# EAGLE board ordered_nobrain_416 (EAGLE 4.16), part 1 of 2
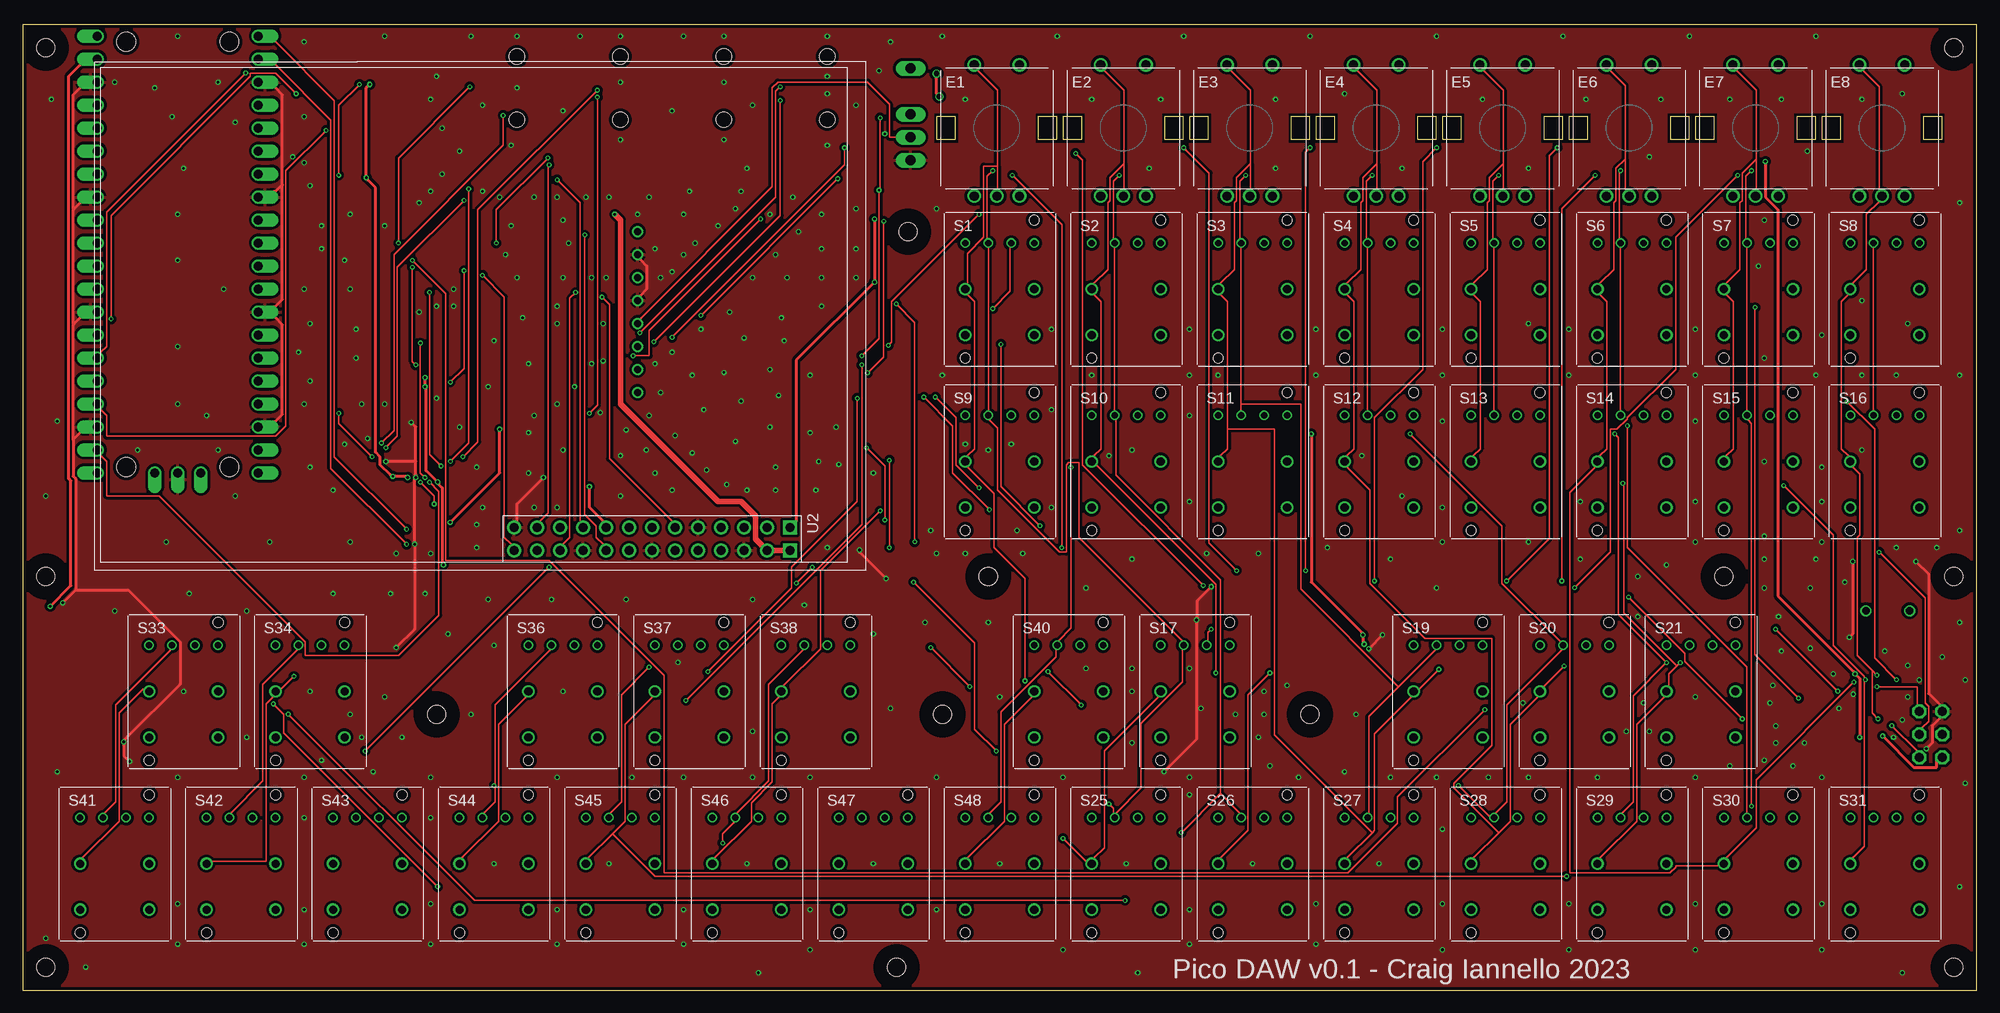
[diagram p1: board, top side]
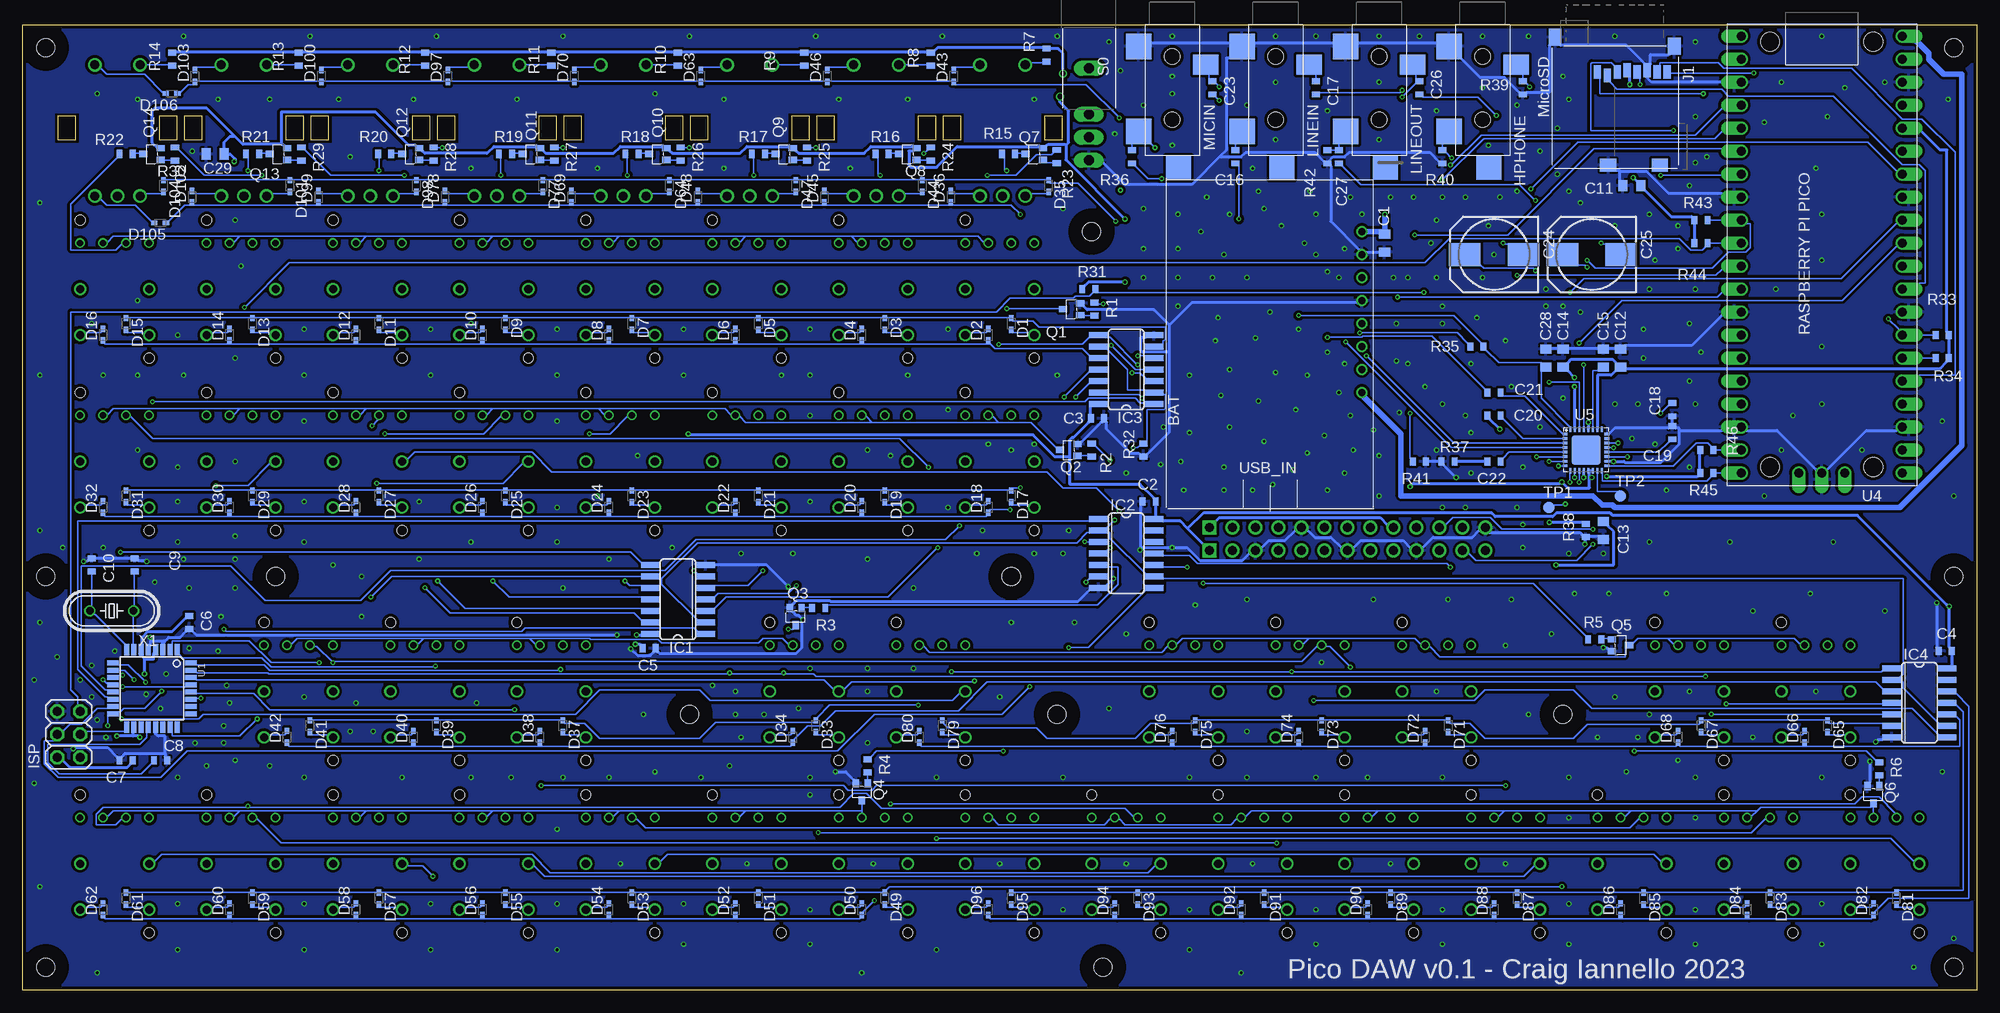
[diagram p2: board, bottom side, seen from below]

Size 215.9 x 106.68 mm. Coordinates in mm from the lower left corner, seen from the top.
Outline: 0,0 215.9,0 215.9,106.68 0,106.68 0,0
Copper layers (1*16): Top 0.0356mm / dielectric 1.6mm / Bottom 0.0356mm
Design rules "oshpark-2layer": minimum track width 6mil, minimum drill 10mil, track to track 6mil, track to pad 6mil, pad to pad 6mil, via to via 6mil, smd to smd 6mil, copper to edge 15mil, drill to drill 6mil, minimum pad ring 5mil, minimum via ring 5mil, stop-mask expansion 2.5mil, vias tented up to drill 0mil, thermal gap 10mil
Net classes: 0 default: width 0.152 mm, drill 0.152 mm, clearance 0.254 mm; 1 high_power: width 0.61 mm, drill 0.33 mm, clearance 0.61 mm; 2 mid_power: width 0.305 mm, drill 0.152 mm, clearance 0.305 mm
Holes 2 mm at 213.36,2.54 213.36,104.14 2.54,104.14 2.54,2.54 45.72,30.48 96.52,2.54 142.24,30.48 97.79,83.82 213.36,45.72 106.68,45.72 2.54,45.72 101.6,30.48 187.96,45.72
tRestrict: area 0,101.6 to 5.1,106.7; area 0,43.2 to 5.1,48.3; area 0,0 to 5.1,5.1; area 43.2,27.9 to 48.3,33; area 99.1,27.9 to 104.1,33; area 104.1,43.2 to 109.2,48.3; area 95.2,81.3 to 100.3,86.4; area 94,0 to 99.1,5.1; area 139.7,27.9 to 144.8,33; area 185.4,43.2 to 190.5,48.3; area 210.8,43.2 to 215.9,48.3; area 210.8,0 to 215.9,5.1; 1 more areas
bRestrict: area 0,101.6 to 5.1,106.7; area 0,43.2 to 5.1,48.3; area 0,0 to 5.1,5.1; area 43.2,27.9 to 48.3,33; area 99.1,27.9 to 104.1,33; area 104.1,43.2 to 109.2,48.3; area 95.2,81.3 to 100.3,86.4; area 94,0 to 99.1,5.1; area 139.7,27.9 to 144.8,33; area 185.4,43.2 to 190.5,48.3; area 210.8,43.2 to 215.9,48.3; area 210.8,0 to 215.9,5.1; 1 more areas

## Footprints (pad centres in the part's own frame; a part is rotated, then mirrored left to right if it is on the bottom)
0805 = smd 1.25 x 1: 1 0,1; 2 0,-1
0603 = smd 0.65 x 0.9: 1 -0.725,0; 2 0.725,0
150CLZ-0810 = smd 3.5 x 2.5: + 3.25,0; - -3.25,0
SOD523 = smd 0.7 x 0.5: A 0.7,0; C -0.6,0
ENCODER_BOURNS_PEC12R-3225F-S0024 = drill 1 round: A -2.5,-7.5; B 2.5,-7.5; COM 0,-7.5; SW0 -2.5,7; SW1 2.5,7
HPHONE_CUI_SJ-3524-SMT-TR = smd 2.2 x 2.8: RING 4.4,3.7 | smd 2.8 x 2.8: SLEEVE 2.4,-3.7; TIP 11.8,-3.7 | smd 2.6 x 2.8: SWITCH 15.8,0.7 | hole 1.7: 3.5,0; 10.5,0
SO14 = smd 0.66 x 2.032: 1 -3.81,-3.073; 2 -2.54,-3.073; 3 -1.27,-3.073; 4 0,-3.073; 5 1.27,-3.073; 6 2.54,-3.073; 7 3.81,-3.073; 8 3.81,3.073; 9 2.54,3.073; 10 1.27,3.073; 11 0,3.073; 12 -1.27,3.073; 13 -2.54,3.073; 14 -3.81,3.073
2X03 = drill 1.016 octagon: 1 -2.54,-1.27; 2 -2.54,1.27; 3 0,-1.27; 4 0,1.27; 5 2.54,-1.27; 6 2.54,1.27
MICROSD_AMPHENOL_GTFP08432B1HR = smd 0.8 x 1.5: 1/DAT2 1.95,1.8; 2/CD/DAT3 0.85,2.2; 3/CMD -0.25,1.8; 4/VDD -1.35,1.6; 5/CLK -2.45,1.8; 6/VSS -3.55,1.6; 7/DAT0 -4.65,1.8; 8/DAT1 -5.75,1.8 | smd 1.8 x 1.4: CDET -4.95,12.1; GND0 0.75,12.1 | smd 1.4 x 1.9: GND1 -6.55,-1.05; GND2 6.6,-2.05
SC-70-3_SOT-323 = smd 0.7 x 0.9: 1 -0.65,-0.95; 2 0.65,-0.95; 3 0,0.95
ROCKER_SPDT_EG4328-ND = drill 1.09 long: 1 0,-5.135; 2 0,-7.675; 3 0,-10.215; ANCH 0,-0.055
PAD_PB86-A1 = drill 0.7 round: A -1.27,5.08; K 1.27,5.08; NC0 -3.81,5.08; NC1 3.81,5.08 | drill 0.9 round: COM0 -3.81,0; COM1 3.81,0; NC 3.81,-5.08; NO -3.81,-5.08 | hole 1.1: -3.81,-7.62; 3.81,7.62
B1,27 = smd 1.27 x 1.27: PP 0,0
TQFP32-08 = smd 1.27 x 0.559: 1 -4.293,2.8; 2 -4.293,2; 3 -4.293,1.2; 4 -4.293,0.4; 5 -4.293,-0.4; 6 -4.293,-1.2; 7 -4.293,-2; 8 -4.293,-2.8; 17 4.293,-2.8; 18 4.293,-2; 19 4.293,-1.2; 20 4.293,-0.4; 21 4.293,0.4; 22 4.293,1.2; 23 4.293,2; 24 4.293,2.8 | smd 0.559 x 1.27: 9 -2.8,-4.293; 10 -2,-4.293; 11 -1.2,-4.293; 12 -0.4,-4.293; 13 0.4,-4.293; 14 1.2,-4.293; 15 2,-4.293; 16 2.8,-4.293; 25 2.8,4.293; 26 2,4.293; 27 1.2,4.293; 28 0.4,4.293; 29 -0.4,4.293; 30 -1.2,4.293; 31 -2,4.293; 32 -2.8,4.293
WAVESHARE_SPI_3.5_480X320 = drill 1.016 square: 1 0,-2.54; 2 0,0 | drill 1.016 round: 3 2.54,-2.54; 4 2.54,0; 5 5.08,-2.54; 6 5.08,0; 7 7.62,-2.54; 8 7.62,0; 9 10.16,-2.54; 10 10.16,0; 11 12.7,-2.54; 12 12.7,0; 13 15.24,-2.54; 14 15.24,0; 15 17.78,-2.54; 16 17.78,0; 17 20.32,-2.54; 18 20.32,0; 19 22.86,-2.54; 20 22.86,0; 21 25.4,-2.54; 22 25.4,0; 23 27.94,-2.54; 24 27.94,0; 25 30.48,-2.54; 26 30.48,0
ADAFRUIT_POWERBOOST_1000C = drill 0.8 round: 5V 8.89,0; BAT -6.35,0; EN -1.27,0; GND0 1.27,0; GND1 6.35,0; LOWBAT 3.81,0; USB -8.89,0; VS -3.81,0
PI_PICO = drill 1 offset: 1 -8.89,24.13; 2 -8.89,21.59; 3 -8.89,19.05; 4 -8.89,16.51; 5 -8.89,13.97; 6 -8.89,11.43; 7 -8.89,8.89; 8 -8.89,6.35; 9 -8.89,3.81; 10 -8.89,1.27; 11 -8.89,-1.27; 12 -8.89,-3.81; 13 -8.89,-6.35; 14 -8.89,-8.89; 15 -8.89,-11.43; 16 -8.89,-13.97; 17 -8.89,-16.51; 18 -8.89,-19.05; 19 -8.89,-21.59; 20 -8.89,-24.13; 21 8.89,-24.13; 22 8.89,-21.59; 23 8.89,-19.05; 24 8.89,-16.51; 25 8.89,-13.97; 26 8.89,-11.43; 27 8.89,-8.89; 28 8.89,-6.35; 29 8.89,-3.81; 30 8.89,-1.27; 31 8.89,1.27; 32 8.89,3.81; 33 8.89,6.35; 34 8.89,8.89; 35 8.89,11.43; 36 8.89,13.97; 37 8.89,16.51; 38 8.89,19.05; 39 8.89,21.59; 40 8.89,24.13; D1 -2.54,-24.13; D2 0,-24.13; D3 2.54,-24.13 | hole 2.1: -5.7,23.5; 5.7,23.5; 5.7,-23.5; -5.7,-23.5
QFN32 = smd 0.6 x 0.3: 1 -2.3,1.75; 2 -2.3,1.25; 3 -2.3,0.75; 4 -2.3,0.25; 5 -2.3,-0.25; 6 -2.3,-0.75; 7 -2.3,-1.25; 8 -2.3,-1.75; 17 2.3,-1.75; 18 2.3,-1.25; 19 2.3,-0.75; 20 2.3,-0.25; 21 2.3,0.25; 22 2.3,0.75; 23 2.3,1.25; 24 2.3,1.75 | smd 0.3 x 0.6: 9 -1.75,-2.3; 10 -1.25,-2.3; 11 -0.75,-2.3; 12 -0.25,-2.3; 13 0.25,-2.3; 14 0.75,-2.3; 15 1.25,-2.3; 16 1.75,-2.3; 25 1.75,2.3; 26 1.25,2.3; 27 0.75,2.3; 28 0.25,2.3; 29 -0.25,2.3; 30 -0.75,2.3; 31 -1.25,2.3; 32 -1.75,2.3 | smd 3.2 x 3.2: EXP 0,0
HC49/S = drill 0.813 round: 1 -2.413,0; 2 2.413,0

## Placement (x,y rotation side)
C1  10u  [0805]  65.43,82.55 0 bottom
C2  0.1u  [0603]  91.44,53.98 180 bottom
C3  0.1u  [0603]  97.16,63.18 0 bottom
C4  0.1u  [0603]  3.49,37.47 180 bottom
C5  0.1u  [0603]  146.69,37.78 0 bottom
C6  0.1u  [0603]  197.49,40.64 270 bottom
C7  0.1u  [0603]  204.47,25.4 180 bottom
C8  0.1u  [0603]  200.66,25.4 0 bottom
C9  22p  [0603]  203.52,46.99 270 bottom
C10  22p  [0603]  208.28,46.99 270 bottom
C11  10u  [0805]  38.1,88.9 270 bottom
C12  10u  [0805]  39.37,69.85 180 bottom
C13  10u  [0805]  41.27,50.8 0 bottom
C14  10u  [0805]  45.72,69.85 180 bottom
C15  10u  [0805]  41.27,69.85 180 bottom
C16  1u  [0603]  81.92,92.08 270 bottom
C17  1u  [0603]  73.03,99.69 270 bottom
C18  1u  [0603]  33.66,64.14 90 bottom
C19  1u  [0603]  33.66,61.59 270 bottom
C20  1u  [0603]  53.34,63.5 0 bottom
C21  1u  [0603]  53.34,66.04 0 bottom
C22  1u  [0603]  53.34,58.42 0 bottom
C23  1u  [0603]  84.45,99.69 270 bottom
C24  220u  [150CLZ-0810]  53.34,81.28 180 bottom
C25  220u  [150CLZ-0810]  42.55,81.28 180 bottom
C26  1u  [0603]  61.59,99.69 90 bottom
C27  1u  [0603]  70.48,92.08 90 bottom
C28  10u  [0805]  47.62,69.85 180 bottom
C29  10u  [0805]  194.63,92.39 270 bottom
D1  [SOD523]  106.68,73.66 270 bottom
D2  [SOD523]  109.22,72.39 90 bottom
D3  [SOD523]  120.65,73.66 270 bottom
D4  [SOD523]  123.19,72.39 90 bottom
D5  [SOD523]  134.62,73.66 270 bottom
D6  [SOD523]  137.16,72.39 90 bottom
D7  [SOD523]  148.59,73.66 270 bottom
D8  [SOD523]  151.13,72.39 90 bottom
D9  [SOD523]  162.56,73.66 270 bottom
D10  [SOD523]  165.1,72.39 90 bottom
D11  [SOD523]  176.53,73.66 270 bottom
D12  [SOD523]  179.07,72.39 90 bottom
D13  [SOD523]  190.5,73.66 270 bottom
D14  [SOD523]  193.04,72.39 90 bottom
D15  [SOD523]  204.47,73.66 270 bottom
D16  [SOD523]  207.01,72.39 90 bottom
D17  [SOD523]  106.68,54.61 270 bottom
D18  [SOD523]  109.22,53.34 90 bottom
D19  [SOD523]  120.65,54.61 270 bottom
D20  [SOD523]  123.19,53.34 90 bottom
D21  [SOD523]  134.62,54.61 270 bottom
D22  [SOD523]  137.16,53.34 90 bottom
D23  [SOD523]  148.59,54.61 270 bottom
D24  [SOD523]  151.13,53.34 90 bottom
D25  [SOD523]  162.56,54.61 270 bottom
D26  [SOD523]  165.1,53.34 90 bottom
D27  [SOD523]  176.53,54.61 270 bottom
D28  [SOD523]  179.07,53.34 90 bottom
D29  [SOD523]  190.5,54.61 270 bottom
D30  [SOD523]  193.04,53.34 90 bottom
D31  [SOD523]  204.47,54.61 270 bottom
D32  [SOD523]  207.01,53.34 90 bottom
D33  [SOD523]  128.27,29.21 270 bottom
D34  [SOD523]  130.81,27.94 90 bottom
D35  [SOD523]  102.55,88.9 270 bottom
D36  [SOD523]  113.35,87.63 90 bottom
D37  [SOD523]  156.21,29.21 270 bottom
D38  [SOD523]  158.75,27.94 90 bottom
D39  [SOD523]  170.18,29.21 270 bottom
D40  [SOD523]  172.72,27.94 90 bottom
D41  [SOD523]  184.15,29.21 270 bottom
D42  [SOD523]  186.69,27.94 90 bottom
D43  [SOD523]  113.03,100.97 90 bottom
D44  [SOD523]  116.52,88.9 270 bottom
D45  [SOD523]  127.32,87.63 90 bottom
D46  [SOD523]  127,100.97 90 bottom
D47  [SOD523]  130.49,88.9 270 bottom
D48  [SOD523]  141.29,87.63 90 bottom
D49  [SOD523]  120.65,10.16 270 bottom
D50  [SOD523]  123.19,8.89 90 bottom
D51  [SOD523]  134.62,10.16 270 bottom
D52  [SOD523]  137.16,8.89 90 bottom
D53  [SOD523]  148.59,10.16 270 bottom
D54  [SOD523]  151.13,8.89 90 bottom
D55  [SOD523]  162.56,10.16 270 bottom
D56  [SOD523]  165.1,8.89 90 bottom
D57  [SOD523]  176.53,10.16 270 bottom
D58  [SOD523]  179.07,8.89 90 bottom
D59  [SOD523]  190.5,10.16 270 bottom
D60  [SOD523]  193.04,8.89 90 bottom
D61  [SOD523]  204.47,10.16 270 bottom
D62  [SOD523]  207.01,8.89 90 bottom
D63  [SOD523]  140.97,100.97 90 bottom
D64  [SOD523]  144.46,88.9 270 bottom
D65  [SOD523]  16.51,29.21 270 bottom
D66  [SOD523]  19.05,27.94 90 bottom
D67  [SOD523]  30.48,29.21 270 bottom
D68  [SOD523]  33.02,27.94 90 bottom
D69  [SOD523]  155.26,87.63 90 bottom
D70  [SOD523]  154.94,100.97 90 bottom
D71  [SOD523]  58.42,29.21 270 bottom
D72  [SOD523]  60.96,27.94 90 bottom
D73  [SOD523]  72.39,29.21 270 bottom
D74  [SOD523]  74.93,27.94 90 bottom
D75  [SOD523]  86.36,29.21 270 bottom
D76  [SOD523]  88.9,27.94 90 bottom
D77  [SOD523]  158.43,88.9 270 bottom
D78  [SOD523]  169.23,87.63 90 bottom
D79  [SOD523]  114.3,29.21 270 bottom
D80  [SOD523]  116.84,27.94 90 bottom
D81  [SOD523]  8.89,10.16 270 bottom
D82  [SOD523]  11.43,8.89 90 bottom
D83  [SOD523]  22.86,10.16 270 bottom
D84  [SOD523]  25.4,8.89 90 bottom
D85  [SOD523]  36.83,10.16 270 bottom
D86  [SOD523]  39.37,8.89 90 bottom
D87  [SOD523]  50.8,10.16 270 bottom
D88  [SOD523]  53.34,8.89 90 bottom
D89  [SOD523]  64.77,10.16 270 bottom
D90  [SOD523]  67.31,8.89 90 bottom
D91  [SOD523]  78.74,10.16 270 bottom
D92  [SOD523]  81.28,8.89 90 bottom
D93  [SOD523]  92.71,10.16 270 bottom
D94  [SOD523]  95.25,8.89 90 bottom
D95  [SOD523]  106.68,10.16 270 bottom
D96  [SOD523]  109.22,8.89 90 bottom
D97  [SOD523]  168.91,100.97 90 bottom
D98  [SOD523]  172.4,88.9 270 bottom
D99  [SOD523]  183.2,87.63 90 bottom
D100  [SOD523]  182.88,100.97 90 bottom
D101  [SOD523]  186.37,88.9 270 bottom
D102  [SOD523]  197.17,87.63 90 bottom
D103  [SOD523]  196.85,100.97 90 bottom
D104  [SOD523]  200.34,88.9 270 bottom
D105  [SOD523]  200.66,84.77 180 bottom
D106  [SOD523]  199.39,99.06 180 bottom
E1  ENCODER_BOURNS_PEC12R-3225F-S0024  [ENCODER_BOURNS_PEC12R-3225F-S0024]  107.63,95.25 0 top
E2  ENCODER_BOURNS_PEC12R-3225F-S0024  [ENCODER_BOURNS_PEC12R-3225F-S0024]  121.6,95.25 0 top
E3  ENCODER_BOURNS_PEC12R-3225F-S0024  [ENCODER_BOURNS_PEC12R-3225F-S0024]  135.57,95.25 0 top
E4  ENCODER_BOURNS_PEC12R-3225F-S0024  [ENCODER_BOURNS_PEC12R-3225F-S0024]  149.54,95.25 0 top
E5  ENCODER_BOURNS_PEC12R-3225F-S0024  [ENCODER_BOURNS_PEC12R-3225F-S0024]  163.51,95.25 0 top
E6  ENCODER_BOURNS_PEC12R-3225F-S0024  [ENCODER_BOURNS_PEC12R-3225F-S0024]  177.48,95.25 0 top
E7  ENCODER_BOURNS_PEC12R-3225F-S0024  [ENCODER_BOURNS_PEC12R-3225F-S0024]  191.45,95.25 0 top
E8  ENCODER_BOURNS_PEC12R-3225F-S0024  [ENCODER_BOURNS_PEC12R-3225F-S0024]  205.42,95.25 0 top
HPHONE  [HPHONE_CUI_SJ-3524-SMT-TR]  54.61,106.68 270 bottom
IC1  74LS164D  [SO14]  143.51,43.18 90 bottom
IC2  74LS164D  [SO14]  93.98,48.26 270 bottom
IC3  74LS164D  [SO14]  93.98,68.58 90 bottom
IC4  74LS164D  [SO14]  6.35,31.75 270 bottom
ISP  [2X03]  210.82,28.26 90 bottom
J1  MICROSD_AMPHENOL_GTFP084328  [MICROSD_AMPHENOL_GTFP08432B1HR]  39.98,103.25 180 bottom
LINEIN  [HPHONE_CUI_SJ-3524-SMT-TR]  77.47,106.68 270 bottom
LINEOUT  [HPHONE_CUI_SJ-3524-SMT-TR]  66.04,106.68 270 bottom
MICIN  [HPHONE_CUI_SJ-3524-SMT-TR]  88.9,106.68 270 bottom
Q1  MMBT2222AWT3G  [SC-70-3_SOT-323]  100.01,75.25 90 bottom
Q2  MMBT2222AWT3G  [SC-70-3_SOT-323]  100.33,59.69 90 bottom
Q3  MMBT2222AWT3G  [SC-70-3_SOT-323]  130.49,41.27 180 bottom
Q4  2N2222MMBT2222AWT3G?  [SC-70-3_SOT-323]  123.19,21.91 180 bottom
Q5  2N2222MMBT2222AWT3G?  [SC-70-3_SOT-323]  39.37,38.1 270 bottom
Q6  2N2222MMBT2222AWT3G?  [SC-70-3_SOT-323]  11.43,21.59 180 bottom
Q7  2N2907MMBT2907AWT1G?  [SC-70-3_SOT-323]  104.14,92.39 90 bottom
Q8  2N2907MMBT2907AWT1G?  [SC-70-3_SOT-323]  118.11,92.39 90 bottom
Q9  2N2907MMBT2907AWT1G?  [SC-70-3_SOT-323]  131.76,92.39 90 bottom
Q10  2N2907MMBT2907AWT1G?  [SC-70-3_SOT-323]  145.73,92.39 90 bottom
Q11  2N2907MMBT2907AWT1G?  [SC-70-3_SOT-323]  159.7,92.39 90 bottom
Q12  2N2907MMBT2907AWT1G?  [SC-70-3_SOT-323]  173.04,92.39 90 bottom
Q13  2N2907MMBT2907AWT1G?  [SC-70-3_SOT-323]  187.64,92.39 90 bottom
Q14  2N2907MMBT2907AWT1G?  [SC-70-3_SOT-323]  201.61,92.39 90 bottom
R1  1K  [0603]  97.47,75.25 270 bottom
R2  1K  [0603]  97.79,59.69 270 bottom
R3  1K  [0603]  127.95,42.23 180 bottom
R4  1K  [0603]  122.56,24.77 270 bottom
R5  1K  [0603]  42.23,38.73 0 bottom
R6  1K  [0603]  10.79,24.45 270 bottom
R7  4.7K  [0603]  102.77,103.33 270 bottom
R8  4.7K  [0603]  115.57,102.87 270 bottom
R9  4.7K  [0603]  129.54,102.87 270 bottom
R10  4.7K  [0603]  143.51,102.87 270 bottom
R11  4.7K  [0603]  157.48,102.87 270 bottom
R12  4.7K  [0603]  171.45,102.87 270 bottom
R13  4.7K  [0603]  185.42,102.87 270 bottom
R14  4.7K  [0603]  199.39,102.87 270 bottom
R15  56R  [0603]  107,92.39 0 bottom
R16  56R  [0603]  120.97,92.39 0 bottom
R17  56R  [0603]  134.62,92.39 0 bottom
R18  56R  [0603]  148.59,92.39 0 bottom
R19  56R  [0603]  162.56,92.39 0 bottom
R20  56R  [0603]  175.9,92.39 0 bottom
R21  56R  [0603]  190.5,92.39 0 bottom
R22  56R  [0603]  204.47,92.39 0 bottom
R23  1K  [0603]  101.65,92.11 270 bottom
R24  1K  [0603]  115.57,92.39 270 bottom
R25  1K  [0603]  129.22,92.39 270 bottom
R26  1K  [0603]  143.19,92.39 270 bottom
R27  1K  [0603]  157.16,92.39 270 bottom
R28  1K  [0603]  170.5,92.39 270 bottom
R29  1K  [0603]  185.1,92.39 270 bottom
R30  1K  [0603]  199.07,92.39 270 bottom
R31  10k  [0603]  98.11,77.47 0 bottom
R32  10k  [0603]  92.08,59.69 270 bottom
R33  10k  [0603]  3.81,72.39 180 bottom
R34  10k  [0603]  3.81,69.85 180 bottom
R35  2.2k  [0603]  55.24,71.12 0 bottom
R36  2.2k  [0603]  93.34,92.08 270 bottom
R37  ?R  [0603]  58.42,58.42 0 bottom
R38  ?R  [0603]  43.18,50.8 90 bottom
R39  ?R  [0603]  50.16,99.69 90 bottom
R40  ?R  [0603]  59.05,92.08 90 bottom
R41  ?R  [0603]  61.59,58.42 180 bottom
R42  ?R  [0603]  71.75,92.08 90 bottom
R43  4.7k  [0603]  30.48,85.09 180 bottom
R44  4.7k  [0603]  30.48,82.55 180 bottom
R45  4.7k  [0603]  29.84,57.15 180 bottom
R46  4.7k  [0603]  29.84,59.69 180 bottom
S0  ROCKEREG4328-ND  [ROCKER_SPDT_EG4328-ND]  98.11,101.92 0 bottom
S1  PB8601-A1  [PAD_PB86-A1]  107.95,77.47 0 top
S2  PB8601-A1  [PAD_PB86-A1]  121.92,77.47 0 top
S3  PB8601-A1  [PAD_PB86-A1]  135.89,77.47 0 top
S4  PB8601-A1  [PAD_PB86-A1]  149.86,77.47 0 top
S5  PB8601-A1  [PAD_PB86-A1]  163.83,77.47 0 top
S6  PB8601-A1  [PAD_PB86-A1]  177.8,77.47 0 top
S7  PB8601-A1  [PAD_PB86-A1]  191.77,77.47 0 top
S8  PB8601-A1  [PAD_PB86-A1]  205.74,77.47 0 top
S9  PB8601-A1  [PAD_PB86-A1]  107.95,58.42 0 top
S10  PB8601-A1  [PAD_PB86-A1]  121.92,58.42 0 top
S11  PB8601-A1  [PAD_PB86-A1]  135.89,58.42 0 top
S12  PB8601-A1  [PAD_PB86-A1]  149.86,58.42 0 top
S13  PB8601-A1  [PAD_PB86-A1]  163.83,58.42 0 top
S14  PB8601-A1  [PAD_PB86-A1]  177.8,58.42 0 top
S15  PB8601-A1  [PAD_PB86-A1]  191.77,58.42 0 top
S16  PB8601-A1  [PAD_PB86-A1]  205.74,58.42 0 top
S17  PB8601-A1  [PAD_PB86-A1]  129.54,33.02 0 top
S19  PB8601-A1  [PAD_PB86-A1]  157.48,33.02 0 top
S20  PB8601-A1  [PAD_PB86-A1]  171.45,33.02 0 top
S21  PB8601-A1  [PAD_PB86-A1]  185.42,33.02 0 top
S25  PB8601-A1  [PAD_PB86-A1]  121.92,13.97 0 top
S26  PB8601-A1  [PAD_PB86-A1]  135.89,13.97 0 top
S27  PB8601-A1  [PAD_PB86-A1]  149.86,13.97 0 top
S28  PB8601-A1  [PAD_PB86-A1]  163.83,13.97 0 top
S29  PB8601-A1  [PAD_PB86-A1]  177.8,13.97 0 top
S30  PB8601-A1  [PAD_PB86-A1]  191.77,13.97 0 top
S31  PB8601-A1  [PAD_PB86-A1]  205.74,13.97 0 top
S33  PB8601-A1  [PAD_PB86-A1]  17.78,33.02 0 top
S34  PB8601-A1  [PAD_PB86-A1]  31.75,33.02 0 top
S36  PB8601-A1  [PAD_PB86-A1]  59.69,33.02 0 top
S37  PB8601-A1  [PAD_PB86-A1]  73.66,33.02 0 top
S38  PB8601-A1  [PAD_PB86-A1]  87.63,33.02 0 top
S40  PB8601-A1  [PAD_PB86-A1]  115.57,33.02 0 top
S41  PB8601-A1  [PAD_PB86-A1]  10.16,13.97 0 top
S42  PB8601-A1  [PAD_PB86-A1]  24.13,13.97 0 top
S43  PB8601-A1  [PAD_PB86-A1]  38.1,13.97 0 top
S44  PB8601-A1  [PAD_PB86-A1]  52.07,13.97 0 top
S45  PB8601-A1  [PAD_PB86-A1]  66.04,13.97 0 top
S46  PB8601-A1  [PAD_PB86-A1]  80.01,13.97 0 top
S47  PB8601-A1  [PAD_PB86-A1]  93.98,13.97 0 top
S48  PB8601-A1  [PAD_PB86-A1]  107.95,13.97 0 top
TP1  TPSB1,27  [B1,27]  47.31,53.34 0 bottom
TP2  TPSB1,27  [B1,27]  39.37,54.61 0 bottom
U1  ATMEGA238PTQFP_  [TQFP32-08]  201.61,33.34 270 bottom
U2  LCD_SPI_3.5_WAVESHARE_480X320  [WAVESHARE_SPI_3.5_480X320]  84.77,48.58 180 top
U3  ADAFRUIT_POWERBOOST_1000C  [ADAFRUIT_POWERBOOST_1000C]  67.94,74.93 90 bottom
U4  PI_PICO  [PI_PICO]  17.14,81.28 0 bottom
U5  AUDIO_CODEC_I2S_SPI_NAU88C22YG_NAU88C22YG-ND  [QFN32]  43.18,59.69 0 bottom
X1  8M  [HC49/S]  206.06,41.91 180 bottom

## Tracks (layer width: path | path; a pad name or v marks a point on that pad's centre or on a via)
+3V3  (via drill 0.3, 0.6)
  Top 0.305: U2.1 85.47,51.82 85.47,69.6 v94.11,78.23 v94.11,85.22 | v38.35,100.08 37.97,99.69 v37.97,89.79 38.1,89.53 38.99,88.65 38.99,59.44 39.5,58.93 39.5,58.04 40.64,56.9 v40.89,56.77 42.55,56.77 v42.55,56.64 | v44.45,67.69 v44.45,66.67 44.58,66.42 44.58,57.4 v45.85,56.13 45.97,55.88 46.35,55.5 46.35,47.12 v46.48,46.99 | v62.61,55.63 62.61,53.34 64.14,51.82 U2.17 | v205.49,28.07 208.91,24.64 211.46,24.64 211.46,25.4 ISP.2 | v202.95,27.94 202.95,34.42 v202.44,34.92 202.31,35.18 193.93,43.56 193.93,86.23 192.53,87.63 v192.53,91.57 | v100.97,101.28 100.97,99.06 v101.28,98.74
  Bottom 0.305: v94.11,78.23 98.17,78.23 98.55,77.85 R31.1 | U2.17 65.15,51.44 65.91,52.2 83.69,52.2 U2.1 | U4.36 6.1,94.87 4.06,92.84 3.3,92.84 3.3,72.77 R33.1 3.05,72.01 3.05,70.23 R34.1 3.3,69.47 4.06,68.71 38.86,68.71 C12.1 | R44.2 31.24,82.93 31.24,84.71 R43.2 31.5,85.47 33.78,85.47 36.7,88.39 C11.1 37.59,89.41 v37.97,89.79 | v38.35,100.08 38.35,100.97 J1.4/VDD | U5.26 41.91,62.23 41.91,67.94 40.39,67.94 39.88,68.45 C12.1 | R46.2 30.61,59.31 30.61,57.53 R45.2 30.86,56.77 v40.89,56.77 | U5.14 42.55,57.4 42.8,57.4 U5.13 42.8,57.15 42.8,56.64 | v44.45,66.67 44.45,62.23 U5.31 | v44.45,67.69 45.21,68.45 C14.1 45.21,69.34 44.83,69.72 40.26,69.72 39.88,69.34 C12.1 | 42.8,56.64 42.8,55.5 45.21,55.5 v45.85,56.13 46.1,56.01 62.23,56.01 v62.61,55.63 | v46.48,46.99 40.13,46.99 40.13,50.67 40.77,51.31 C13.1 | 42.8,56.64 v42.55,56.64 | R14.1 199.01,103.63 185.8,103.63 R13.1 185.04,103.63 171.83,103.63 R12.1 171.07,103.63 157.86,103.63 R11.1 157.1,103.63 143.89,103.63 R10.1 143.13,103.63 129.92,103.63 R9.1 129.16,103.63 115.95,103.63 R8.1 115.19,103.76 114.81,104.14 103.12,104.14 | C6.1 197.87,41.15 199.39,39.62 202.06,39.62 202.69,38.99 202.69,38.23 U1.6 202.95,37.08 202.44,36.58 | 202.44,36.58 201.42,36.58 201.42,37.08 U1.4 | C7.1 203.96,25.02 204.34,24.64 210.69,24.64 211.46,25.4 ISP.2 | 203.71,28.07 203.71,28.45 U1.18 | 203.71,28.07 v205.49,28.07 | v202.95,27.94 203.07,28.07 203.71,28.07 | v202.44,34.92 202.44,36.58 | 187.32,93.47 187.2,93.47 187.07,93.34 Q13.2 | 187.32,93.47 187.32,97.03 176.91,97.03 173.23,93.34 172.47,93.34 Q12.2 171.7,92.71 171.45,92.46 164.59,92.46 163.83,93.22 159.13,93.22 Q11.2 158.37,92.71 158.12,92.46 150.62,92.46 149.86,93.22 145.16,93.22 Q10.2 144.4,92.71 144.15,92.46 136.65,92.46 135.89,93.22 131.19,93.22 Q9.2 130.43,92.71 130.18,92.46 122.94,92.46 122.17,93.22 117.6,93.22 Q8.2 117.6,92.71 117.98,92.71 117.98,91.19 117.73,90.93 114.94,90.93 112.65,93.22 103.63,93.22 Q7.2 102.74,93.34 102.62,93.47 100.78,93.47 100.65,93.34
  Bottom 0.305: v100.97,101.28 100.97,103.5 101.51,104.05 R7.1 103.12,104.14 | v101.28,98.74 101.28,98.11 100.33,97.16 100.33,93.66 100.65,93.34 | 103.12,104.14 102.87,104.14 | v94.11,85.22 100.65,91.76 100.65,93.34 | C29.1 192.98,92.39 192.41,91.82 192.41,91.69 v192.53,91.57 | C29.1 193.68,92.44 | 187.32,93.47 191.58,93.47 | 191.58,93.47 195.58,97.47 201.29,97.47 201.61,97.16 201.61,93.66 200.98,93.03 200.66,93.03 Q14.2 | 191.58,93.47 192.41,94.3 193.04,94.3 193.68,93.66 193.68,92.39 C29.1
/RST  (via drill 0.25)
  Top 0.152: v204.85,33.53 209.3,33.53 209.3,31.5 ISP.5 | v61.09,77.09 60.45,76.45 60.45,50.04 59.69,49.28 U2.22
  Bottom 0.152: v204.85,33.53 197.87,33.53 U1.29 | v61.09,77.09 97.16,77.09 R31.2 97.66,77.09 98.04,76.71 99.57,76.71 99.82,76.45 106.81,76.45 108.33,74.93 210.57,74.93 210.57,33.15 209.8,32.38 209.8,31.5 ISP.5
A_BCK  (via drill 0.25)
  Top 0.152: v46.23,57.91 44.96,59.18 v44.96,77.09
  Bottom 0.152: v46.23,57.91 45.72,57.91 U5.8 | v44.96,77.09 43.43,78.61 14.99,78.61 8.89,84.71 U4.32
A_DIN  (via drill 0.25)
  Top 0.152: v44.96,56.13 45.97,55.12 45.97,41.4 41.53,36.96 31.24,36.96 31.24,38.48 15.11,54.61 9.27,54.61 9.27,58.42 8.64,59.05 U4.22
  Bottom 0.152: v44.96,56.13 44.96,57.15 U5.9
A_DOUT  (via drill 0.25)
  Top 0.152: v44.45,56.64 43.94,57.15 v43.94,71.5
  Bottom 0.152: v44.45,56.64 44.45,57.15 U5.10 | v43.94,71.5 39.24,76.2 14.86,76.2 8.89,82.17 U4.31
A_LRCLK  (via drill 0.25)
  Top 0.152: v47.24,58.42 49.28,60.45 v49.28,88.52
  Bottom 0.152: v47.24,58.42 45.72,58.42 U5.7 | v49.28,88.52 44.07,93.73 12.06,93.73 8.89,90.55 U4.34
A_SCL
  Bottom 0.152: U5.16 41.4,57.15 41.4,56.26 29.84,56.26 29.34,56.77 R45.1 U4.20
A_SDA
  Bottom 0.152: U5.17 40.64,57.91 33.53,57.91 30.99,60.45 29.72,60.45 29.34,60.07 R46.1 U4.19
D_CS  (via drill 0.25)
  Top 0.152: v42.42,49.28 34.04,57.66 34.04,96.14 27.94,102.23 U4.2
  Bottom 0.152: v42.42,49.28 44.2,47.5 55.37,47.5 56.13,48.26 U2.24
D_MISO  (via drill 0.25)
  Top 0.152: v42.42,50.93 34.42,58.93 34.42,98.3 27.94,104.78 U4.1
  Bottom 0.152: v42.42,50.93 52.45,50.93 53.72,52.2 57.91,52.2 58.67,51.44 U2.21
D_MOSI  (via drill 0.25)
  Top 0.152: v59.05,89.53 61.59,87 61.59,51.82 U2.19
  Bottom 0.152: v59.05,89.53 54.48,94.11 28.96,94.11 28.19,94.87 U4.5
D_RS  (via drill 0.25)
  Top 0.152: v62.1,83.44 62.1,52.58 63.37,51.31 63.37,50.04 64.14,49.28 U2.18
  Bottom 0.152: v62.1,83.44 51.82,83.44 42.29,92.96 28.19,92.96 U4.6
D_SCK  (via drill 0.25)
  Top 0.152: v58.17,91.19 58.04,91.06 58.04,52.7 57.15,51.82 U2.23
  Bottom 0.152: v58.17,91.19 58.04,91.19 54.74,94.49 31.11,94.49 28.19,97.41 U4.4
GND  (via drill 0.3)
  Top 0.305: v209.17,47.37 210.57,45.97 210.57,32.77 211.84,31.5 ISP.6 211.84,30.1 210.95,29.21 210.95,27.3 v210.31,26.67 | v201.8,38.99 202.18,39.37 v202.18,47.37 | v126.11,24.13 129.67,27.69 v129.67,40.89 129.79,41.15 129.79,43.05 v131.32,44.58 | v150.24,39.24 v148.72,37.72 | U3.GND0 68.2,76.71 68.96,77.47 68.96,80.01 68.2,80.77 U3.GND1 | 28.64,88.96 28.7,89.03 28.7,98.93 27.94,99.69 U4.3 | 28.64,88.96 27.94,88.27 U4.8 | 28.64,88.96 28.7,88.9 28.7,76.33 27.94,75.56 U4.13 27.94,74.3 28.7,73.53 28.7,63.63 27.94,62.87 U4.18 | v42.93,62.74 43.43,62.23 43.43,58.42 | 43.43,58.42 v43.43,56.64 43.31,56.39 v43.31,49.28 43.31,39.88 v41.27,37.85 | v57.53,56.64 54.61,53.72 54.61,51.82 U2.25 | v11.81,25.27 11.18,25.91 v11.18,27.43 11.3,27.69 17.4,33.78 17.4,38.48 11.68,44.2 5.84,44.2 | 5.84,44.2 v4.45,42.8 | 5.84,44.2 5.84,56.52 5.59,56.77 5.59,60.83 | 5.59,60.83 6.35,61.59 U4.23 | 5.65,73.6 5.59,73.53 5.59,60.83 | 5.65,73.6 6.35,74.3 U4.28 | 5.65,86.3 5.59,86.23 5.59,73.66 5.65,73.6 | 5.65,86.3 6.35,87 U4.33 | U4.38 6.35,99.69 5.59,98.93 5.59,86.36 5.65,86.3 | 43.43,58.42 v40.13,58.42 | v95.38,45.47 92.46,48.39 v92.46,48.64
  Bottom 0.305: 200.15,26.16 200.15,28.07 200.91,28.07 201.29,28.45 U1.21 | 200.15,26.16 200.15,25.78 C8.2 | 200.15,26.16 204.6,26.16 204.98,25.78 C7.2 205.49,25.78 206.5,26.8 210.19,26.8 v210.31,26.67 | 200.22,38.54 200.53,38.23 U1.3 | 200.22,38.54 199.77,38.99 198.5,38.99 197.87,39.62 C6.2 197.1,39.62 196.72,39.24 v150.24,39.24 | 201.8,38.61 201.8,38.23 U1.5 | 201.8,38.61 200.28,38.61 200.22,38.54 | v209.17,47.37 208.79,47.37 208.66,47.5 C10.1 207.9,47.75 203.96,47.75 C9.1 203.07,47.5 202.31,47.5 v202.18,47.37 | v201.8,38.99 201.8,38.61 | v126.11,24.13 124.97,24.13 124.08,23.24 Q4.2 | v131.32,44.58 133.73,46.99 IC1.7 | v148.72,37.72 147.96,36.96 146.56,36.96 146.18,37.34 C5.2 145.67,37.34 145.54,37.21 130.43,37.21 129.79,37.85 129.79,40.64 v129.67,40.89 130.18,41.4 130.43,41.4 130.81,41.78 Q3.2 130.81,42.67 130.43,43.05 126.75,43.05 126.62,42.93 99.31,42.93 98.04,44.2 IC2.7 96.14,44.7 v95.38,45.47 | Q2.2 98.93,60.58 96.77,62.74 96.65,62.74 C3.2 96.14,62.74 96.14,61.98 93.47,59.31 92.58,59.31 92.46,59.18 R32.2 91.69,59.18 89.28,61.59 89.28,70.48 | 89.28,73.53 90.93,75.18 98.3,75.18 98.68,75.56 Q1.2 | 89.28,73.53 89.28,70.48 | 89.28,70.48 92.2,70.48 92.33,70.61 92.33,72.14 91.82,72.14 IC3.7 | C1.2 66.04,81.53 67.44,81.53 U3.GND1 68.2,81.79 71.37,84.96 71.37,91.06 R42.1 | R40.1 59.44,91.57 60.45,92.58 69.34,92.58 69.85,92.08 71.12,92.08 71.63,91.57 R42.1 | 89.28,73.53 89.15,73.53 86.74,75.95 68.45,75.95 U3.GND0 | LINEIN.SLEEVE 79.88,104.65 71.12,104.65 LINEOUT.SLEEVE 68.45,104.65 59.69,104.65 HPHONE.SLEEVE 57.02,103 54.86,100.84 52.2,100.84 50.55,99.19 R39.1 49.78,99.19 47.24,99.19 47.24,104.39 J1.GND2 45.97,104.39 38.73,104.39 36.7,102.36 J1.6/VSS
  Bottom 0.305: MICIN.SLEEVE 91.31,104.65 82.55,104.65 LINEIN.SLEEVE | 83.63,92.14 82.93,92.84 82.93,103 82.55,103 LINEIN.SLEEVE | 83.63,92.14 86.74,89.03 94.11,89.03 96.52,91.44 S0.3 | C28.2 47.12,70.87 46.23,70.87 C14.2 45.21,70.87 41.78,70.87 C15.2 40.77,70.87 39.88,70.87 C12.2 38.86,71.25 31.5,71.25 28.19,74.55 U4.13 | 39.5,90.42 39.5,90.55 39.88,90.55 J1.GND0 | 39.5,90.42 39.5,89.41 C11.2 | 39.5,90.42 36.45,90.42 34.04,88.01 28.19,88.01 U4.8 | J1.6/VSS 36.07,102.36 36.07,103.38 34.04,103.38 J1.GND1 | U4.3 35.94,100.33 36.58,100.97 J1.6/VSS | R42.1 72.14,91.57 73.15,92.58 80.77,92.58 81.28,92.08 83.57,92.08 83.63,92.14 | 92.33,48.9 92.33,53.59 C2.2 | 92.33,48.9 87.25,48.9 85.85,47.5 81.15,47.5 80.39,48.26 U2.6 78.99,48.9 78.23,49.66 76.45,49.66 75.31,50.8 U2.9 73.91,50.8 73.15,50.04 71.37,50.04 70.23,48.9 U2.14 68.83,48.9 68.07,49.66 63.37,49.66 62.61,48.9 U2.20 61.21,48.9 60.07,50.04 55.75,50.04 54.99,50.8 U2.25 53.85,50.55 43.81,50.55 43.56,50.29 R38.1 | v42.93,62.74 42.93,62.23 U5.28 | v43.43,56.64 43.43,57.15 U5.12 | v41.27,37.85 40.89,37.85 40.77,37.72 Q5.2 | R38.1 42.8,50.16 41.78,50.16 C13.2 | R41.1 R37.1 58.93,58.04 v57.53,56.64 | v43.31,49.28 43.31,49.78 R38.1 | 32.89,61.85 32.89,62.1 33.27,62.1 C19.1 | 32.89,61.85 32.89,60.33 34.92,58.29 38.86,58.29 38.99,58.42 v40.13,58.42 40.64,58.42 U5.18 | U5.24 40.64,61.47 40.01,62.1 34.04,62.1 C19.1 | C19.1 C18.1 | 32.89,61.85 28.19,61.85 U4.18 25.4,61.85 22.1,61.85 17.78,57.53 U4.D2 16.51,57.53 12.19,61.85 8.89,61.85 U4.23 | v11.81,25.27 11.81,22.99 Q6.2 | v11.18,27.43 10.92,27.69 10.41,27.69 IC4.7 | v4.45,42.8 4.45,37.85 C4.2
  Bottom 0.305: v92.46,48.64 92.33,48.77 92.33,48.9
  other vias: 54.61,105.41 49.53,105.41 66.04,105.41 61.59,105.41 73.03,105.41 77.47,105.41 88.9,105.41 94.61,101.6 66.04,100.33 54.61,99.69 77.47,100.33 88.9,100.97 88.9,99.06 88.9,93.34 77.47,93.98 66.04,93.98 53.98,93.34 48.26,92.71 50.8,97.79 59.69,97.16 71.75,97.16 80.64,97.79 92.08,97.79 95.25,94.61 95.89,104.78 69.22,87.63 80.01,90.81 85.09,87.63 88.27,85.72 92.08,86.36 70.48,78.74 80.64,78.74 83.19,81.28 74.3,82.55 78.74,86.36 85.72,83.82 71.75,70.48 74.93,73.03 78.11,74.93 87,67.94 87.63,55.24 83.19,55.24 80.01,55.24 71.75,55.24 66.04,54.61 63.82,63.82 64.14,69.53 64.45,78.74 64.77,87.63 62.23,87.63 56.52,87.63 59.05,87.63 52.7,87.63 50.8,88.27 45.09,88.27 46.35,90.17 46.35,95.25 45.72,100.97 31.11,104.78 31.11,96.52 31.11,91.44 29.84,92.08 31.75,88.9 33.02,84.45 36.2,85.72 43.81,87 45.09,98.42 40.01,105.41 3.17,98.42 10.16,100.33 14.61,99.69 16.51,96.52 23.5,95.89 17.14,105.41 17.14,71.12 17.14,64.77 3.81,62.87 2.54,54.61 23.5,54.61 21.59,59.69 12.7,59.69 31.11,64.77 30.48,70.48 31.75,73.66 31.11,77.47 36.2,77.47 36.83,73.03 36.83,69.85 37.47,64.77 40.01,64.77 45.72,65.41 51.44,66.67 52.07,71.75 53.34,81.28 54.61,78.74 55.24,74.3 59.69,78.74 60.33,82.55 62.87,69.22 60.96,66.67 59.05,64.77 56.52,63.5 50.16,57.78 55.88,57.15 50.8,53.34 50.16,48.9 36.2,49.53 34.29,55.24 31.75,57.78 41.27,48.26 45.09,48.26 44.45,43.81 40.64,43.81 15.88,49.53 27.3,49.53 43.81,74.93 45.72,75.56 47.62,75.56 47.62,77.47 55.88,69.22 59.05,73.66 59.05,75.56 62.87,78.74 73.66,88.27 88.27,75.56 92.08,78.74 72.07,61.28 69.22,63.5 66.04,59.05 53.98,84.45 40.01,84.45 35.56,80.64 50.16,51.44 56.52,53.34 59.05,53.34 59.69,59.69 48.26,62.23 38.1,60.96 35.56,60.33 3.81,24.13 6.99,2.54 81.28,1.91 123.19,1.91 207.65,1.91 214,11.43 214.63,34.29 200.66,31.11 214,67.94 214,87 198.12,105.41 184.15,105.41 170.18,105.41 156.21,105.41 142.24,105.41 128.27,105.41 114.3,105.41 101.6,105.41 100.97,86.36 101.6,67.94 100.97,48.26 156.84,49.53 184.78,49.53 198.75,49.53 198.12,67.94 184.78,67.94 170.81,67.94 156.84,67.94 142.88,67.94 128.91,67.94 156.84,4.45 170.81,4.45 198.75,4.45 184.78,4.45 142.88,5.08 128.91,5.08 114.94,4.45 87,4.45 73.03,5.08 59.05,5.08 45.09,5.08 31.11,5.08 17.14,5.08 2.54,5.71 17.14,23.5 31.11,23.5 45.09,23.5 59.05,23.5 67.31,23.5 80.64,23.5 87,23.5 73.03,23.5 100.97,23.5 80.64,43.18 66.67,43.18 51.44,43.18 58.42,43.18 114.94,23.5 128.91,23.5 140.97,23.5 146.05,24.13 151.13,23.5 156.21,23.5 161.93,23.5 166.37,23.5 173.99,23.5 184.78,23.5 198.75,23.5 214.63,22.86 178.44,45.72 181.61,46.99 172.09,47.62 166.37,49.53 156.21,44.45 151.13,47.62 144.15,48.9 136.53,48.26 130.81,48.26 122.56,47.62 117.47,44.45 110.49,48.26 106.68,40.64 99.69,40.64 93.98,39.37 86.36,42.55 147.32,30.48 76.83,84.45 69.85,69.22 64.14,73.66 59.69,85.09 33.02,81.92 70.48,66.04 55.88,61.59 79.38,88.27 73.03,81.28 71.75,79.38 31.75,67.31 20.32,63.5 17.14,80.64 17.78,90.81 21.59,100.33 17.14,85.72 66.67,61.91 95.89,31.11 38.73,24.13 49.53,30.48 46.99,39.37 52.07,38.1 34.29,43.81 24.77,41.91 18.41,43.81 10.16,41.91 214,50.8 214,40.64 104.14,48.26 83.82,74.3 87,61.59 82.55,68.58 82.55,62.23 83.19,57.78 69.85,57.15 84.45,78.74 88.27,78.74 88.27,81.92 92.08,81.92 73.03,85.72 69.85,81.92 67.94,85.72 197.49,44.45 195.58,24.77 212.09,36.83 192.41,47.62 192.41,50.16 192.41,58.42 192.41,69.85 191.77,80.01 192.41,85.09 203.2,76.2 203.2,67.94 207.01,67.94 203.2,59.69 192.41,44.45 193.99,41.27 200.03,34.92 193.68,29.21 193.68,27.3 196.85,27.3 192.41,25.4 188.59,24.77 193.04,31.75 184.78,32.38 198.75,53.98 198.75,57.78 208.28,73.66 147.96,59.05 109.22,60.33 106.68,59.69 120.02,59.05 122.56,59.69 194.31,37.47 208.28,32.38 201.29,45.09 207.65,29.84 202.25,32.7 207.01,48.9 198.12,47.62 211.46,48.9 209.55,34.29 208.28,35.88 197.49,37.78 193.36,33.66 205.74,37.47 206.69,27.94 132.08,67.94 118.11,67.94 82.55,85.72 178.44,41.27 165.74,31.75 179.07,31.75 104.14,60.33 93.98,57.15 100.33,50.8 107.95,32.38 88.9,48.9 40.01,32.38 37.47,27.94 36.2,30.48 17.78,33.02 133.99,30.48 137.16,30.48 130.18,31.11 136.53,27.94 137.79,24.77 113.67,53.34 128.91,53.98 156.84,53.34 184.78,53.98 184.78,62.87 184.78,73.03 194.31,98.42 207.65,99.06 203.2,98.42 188.59,98.42 197.17,92.71 180.97,98.42 179.71,92.08 172.72,98.42 161.29,98.42 146.05,99.06 138.43,98.42 125.73,98.42 118.11,98.42 104.14,98.42 124.46,90.81 138.43,90.81 152.4,90.81 166.37,90.81 156.84,73.03 198.75,72.39 142.88,73.03 128.91,73.03 128.91,63.5 113.67,73.03 113.67,64.14 109.86,50.8 172.09,53.98 152.4,54.61 117.47,35.56 72.39,36.2 80.64,28.57 41.91,27.94 52.07,13.97 64.77,13.97 93.98,13.97 80.01,13.97 107.95,13.97 121.92,13.97 135.89,13.97 149.86,13.97 156.84,17.78 170.81,9.53 184.78,9.53 198.75,9.53 177.16,28.57 179.71,28.57 137.16,33.02 139.7,33.66 122.56,33.02 122.56,27.3 122.56,35.56 128.91,35.56 31.75,33.02 59.69,33.02 59.05,8.89 73.03,8.89 87,8.89 100.97,8.89 128.91,8.89 142.88,9.53 156.84,9.53 45.09,9.53 45.09,19.05 31.11,19.05 31.11,8.89 17.14,9.53 22.23,77.47 33.02,25.4 24.77,27.94 128.91,21.59 156.84,62.87 170.81,73.03 166.37,73.66 75.56,57.47 73.98,59.37 68.9,59.69 77.79,55.88 78.74,60.64 75.25,64.14 77.47,68.26 90.17,58.1 79.69,72.07 73.98,67.94 84.14,71.75 83.5,65.72 79.38,65.09 89.85,62.23 87.95,58.42
  pour Top: 0,106.68 215.9,106.68 215.9,0 0,0
  pour Bottom: 0,106.68 215.9,106.68 215.9,0 0,0
K_SCL  (via drill 0.25)
  Top 0.152: v161.54,30.99 151.89,21.34 151.89,18.41 146.43,12.95 70.87,12.95 70.87,34.8 58.17,47.5 46.74,47.5 46.74,76.96 v43.05,80.64
  Bottom 0.152: R43.1 U4.9 25.4,84.71 25.02,84.71 25.02,82.04 25.53,81.53 27.43,81.53 29.21,79.76 42.16,79.76 v43.05,80.64 | v161.54,30.99 188.59,30.99 190.37,32.77 196.72,32.77 U1.28
K_SDA  (via drill 0.25)
  Top 0.152: v196.22,32.26 191.39,37.08 v191.39,75.44
  Bottom 0.152: U4.10 R44.1 29.97,82.17 30.35,81.79 31.62,81.79 32.89,83.06 58.29,83.06 60.96,80.39 186.44,80.39 v191.39,75.44 | v196.22,32.26 196.72,32.26 U1.27
LC1  (via drill 0.25)
  Top 0.152: v116.33,92.46 117.09,91.69 117.09,58.04 v130.43,44.7
  Bottom 0.152: v116.33,92.46 115.95,92.84 R24.1 | v130.43,44.7 131.32,43.81 139.06,43.81 139.45,43.43 IC1.4
LC2  (via drill 0.25)
  Top 0.152: v128.27,93.09 131.06,90.3 131.06,49.4 v134.11,46.35
  Bottom 0.152: v128.27,93.09 128.78,93.09 R25.1 | v134.11,46.35 135.76,44.7 139.45,44.7 IC1.5
LC3  (via drill 0.25)
  Top 0.152: v142.24,93.09 141.73,92.58 v141.73,46.35
  Bottom 0.152: v142.24,93.09 142.75,93.09 R26.1 | v141.73,46.35 141.35,45.97 IC1.6
LC4  (via drill 0.25)
  Top 0.152: v156.21,93.09 154.69,91.57 154.69,68.58 149.35,63.25 v149.35,45.21
  Bottom 0.152: v156.21,93.09 156.72,93.09 R27.1 | v149.35,45.21 148.84,44.7 147.57,44.7 IC1.10
LC5  (via drill 0.25)
  Top 0.152: v169.54,93.09 168.66,92.2 168.66,49.91 v163.96,45.21
  Bottom 0.152: v169.54,93.09 170.05,93.09 R28.1 | v163.96,45.21 162.18,43.43 147.57,43.43 IC1.11
LC6  (via drill 0.25)
  Top 0.152: v173.74,90.04 170.05,86.36 v170.05,45.21
  Bottom 0.152: v173.74,90.04 181.86,90.04 184.66,92.84 R29.1 | v170.05,45.21 167,42.16 147.57,42.16 IC1.12
LC7  (via drill 0.25)
  Top 0.152: v189.48,90.04 182.63,83.19 182.63,68.58 177.29,63.25 177.29,63.12 176.15,61.98 175.39,61.98 175.39,48.39 v171.45,44.45
  Bottom 0.152: v189.48,90.04 195.83,90.04 198.63,92.84 R30.1 | v171.45,44.45 168.66,41.66 148.34,41.66 147.57,40.89 IC1.13
LCCLK  (via drill 0.25)
  Top 0.152: v205.1,48.39 210.19,43.31 210.19,31.75 210.57,31.37 210.57,29.72 209.8,28.96 ISP.3
  Bottom 0.152: U1.17 204.6,28.57 208.91,28.57 ISP.3 | v205.1,48.39 148.72,48.39 147.57,47.24 IC1.8
LCDAT  (via drill 0.25)
  Top 0.152: v206.5,29.21 209.3,26.42 ISP.1 | v193.68,39.88 v200.53,33.02
  Bottom 0.152: v206.5,29.21 206.5,30.35 U1.16 205.36,30.73 205.1,30.73 204.72,31.11 202.44,31.11 v200.53,33.02 | v193.68,39.88 193.42,39.62 160.78,39.62 160.4,40.01 141.73,40.01 141.35,39.62 IC1.1
LHP  (via drill 0.25)
  Top 0.152: v58.04,91.95 52.32,86.23 v52.32,82.55
  Bottom 0.152: HPHONE.TIP 59.05,93.6 R40.2 58.67,92.58 v58.04,91.95 | v52.32,82.55 52.2,82.42 51.82,82.42 C24.-
LLIN
  Bottom 0.152: C16.1 81.92,93.6 LINEIN.TIP
LLOUT
  Bottom 0.152: R42.2 71.37,92.84 70.87,92.84 C27.2 70.48,93.6 LINEOUT.TIP
LM+  (via drill 0.25)
  Top 0.152: v71.75,72.14 90.81,91.19 v90.81,93.09
  Bottom 0.152: v71.75,72.14 67.94,72.14 67.82,72.26 60.2,72.26 54.36,66.42 C21.1 | v90.81,93.09 91.31,93.6 MICIN.TIP 93.34,93.6 R36.1
LM-  (via drill 0.3)
  Top 0.305: v47.24,51.69 52.7,57.15 v52.7,61.98
  Bottom 0.305: v47.24,51.69 43.56,51.69 R38.2 | v52.7,61.98 53.85,63.12 C20.1
LRCLK  (via drill 0.25)
  Top 0.152: v100.33,37.85 v104.65,33.53
  Bottom 0.152: U1.15 206.5,31.11 207.65,31.11 209.42,29.34 210.69,29.34 211.46,28.57 ISP.4 212.34,27.56 213.49,27.56 213.49,25.02 211.96,23.5 200.66,23.5 197.74,26.42 125.86,26.42 121.79,30.48 107.7,30.48 v104.65,33.53 | v100.33,37.85 98.17,37.85 91.82,44.2 IC2.8
LRDAT
  Bottom 0.152: U1.14 206.5,32.38 206.76,32.38 209.8,35.43 209.8,51.82 98.04,51.82 IC2.1
N$1  (via drill 0.25)
  Top 0.152: v107.19,75.31 109.09,77.22 109.09,82.04 S1.K
  Bottom 0.152: v107.19,75.31 101.35,75.31 Q1.3 | 124.33,83.31 123.7,82.68 S2.K | 136.02,83.31 124.33,83.31 | 136.02,83.31 136.65,82.68 S3.K | 149.99,83.31 150.62,82.68 S4.K | 149.99,83.31 136.02,83.31 | 163.96,83.31 164.59,82.68 S5.K | 163.96,83.31 149.99,83.31 | 177.93,83.31 178.56,82.68 S6.K | 177.93,83.31 163.96,83.31 | 191.9,83.31 192.53,82.68 S7.K | 177.93,83.31 191.9,83.31 | 191.9,83.31 205.87,83.31 206.5,82.68 S8.K | 124.33,83.31 110.36,83.31 109.73,82.68 S1.K
N$2  (via drill 0.25)
  Top 0.152: v93.34,68.2 95.12,69.98 v95.12,84.96
  Bottom 0.152: D104.C 200.15,89.53 186.56,89.53 D101.C 186.18,89.53 172.59,89.53 D98.C 172.21,89.53 158.62,89.53 D77.C 158.24,89.53 144.65,89.53 D64.C 144.27,89.53 130.68,89.53 D47.C 130.3,89.53 116.71,89.53 D44.C 116.33,89.53 102.74,89.53 D35.C 102.36,89.15 99.31,89.15 v95.12,84.96 | v93.34,68.2 92.46,68.2 91.82,67.56 IC3.3
N$3  (via drill 0.25)
  Top 0.152: v95.63,71.25 96.01,71.63 96.01,76.07 v105.66,85.72
  Bottom 0.152: D105.C 199.77,84.96 197.99,86.74 197.36,86.74 D102.C 196.98,86.74 183.39,86.74 D99.C 183.01,86.74 169.42,86.74 D78.C 169.04,86.74 155.45,86.74 D69.C 155.07,86.74 141.48,86.74 D48.C 141.1,86.74 127.51,86.74 D45.C 127.13,86.74 113.54,86.74 D36.C 113.16,86.74 106.68,86.74 v105.66,85.72 | v95.63,71.25 92.96,68.58 IC3.4
N$4
  Bottom 0.152: D15.C 204.34,74.3 190.63,74.3 D13.C 190.37,74.3 176.66,74.3 D11.C 176.4,74.3 162.69,74.3 D9.C 162.43,74.3 148.72,74.3 D7.C 148.46,74.3 134.75,74.3 D5.C 134.49,74.3 120.78,74.3 D3.C 120.52,74.3 106.81,74.3 D1.C 106.55,73.91 104.27,73.91 103.63,73.28 89.66,73.28 89.66,71.88 89.79,71.75 89.92,71.75 89.92,71.37 IC3.6
N$5
  Bottom 0.152: D1.A 106.55,72.64 104.78,72.64 S1.NO
N$6
  Bottom 0.152: D2.A 109.35,72.77 109.47,72.64 111.12,72.64 S1.NC
N$7
  Bottom 0.152: 108.97,71.37 108.46,70.87 98.81,70.87 98.04,70.1 IC3.10 | 108.97,71.37 109.09,71.5 D2.C | 122.94,71.37 123.06,71.5 D4.C | 122.94,71.37 108.97,71.37 | 136.91,71.37 137.03,71.5 D6.C | 136.91,71.37 122.94,71.37 | 150.88,71.37 151,71.5 D8.C | 150.88,71.37 136.91,71.37 | 164.85,71.37 164.97,71.5 D10.C | 164.85,71.37 150.88,71.37 | 178.82,71.37 178.94,71.5 D12.C | 178.82,71.37 164.85,71.37 | 192.79,71.37 192.91,71.5 D14.C | 192.79,71.37 178.82,71.37 | 192.79,71.37 206.76,71.37 206.88,71.5 D16.C
N$9
  Bottom 0.152: D3.A 120.52,72.64 118.75,72.64 S2.NO
N$10  (via drill 0.25)
  Top 0.152: v92.71,70.1 94.61,72.01 v94.61,88.39 94.74,88.52 v94.74,96.39
  Bottom 0.152: D106.C 198.5,99.19 197.61,100.08 196.98,100.08 D103.C 196.72,100.46 183.01,100.46 D100.C 182.75,100.46 169.04,100.46 D97.C 168.78,100.46 155.07,100.46 D70.C 154.81,100.46 141.1,100.46 D63.C 140.84,100.46 127.13,100.46 D46.C 126.87,100.46 113.16,100.46 D43.C 112.9,100.08 98.42,100.08 v94.74,96.39 | v92.71,70.1 91.82,70.1 IC3.5
N$11
  Bottom 0.152: D4.A 123.32,72.77 123.44,72.64 125.09,72.64 S2.NC
N$12
  Bottom 0.152: D43.A 112.9,101.98 110.87,101.98 E1.SW1
N$13
  Bottom 0.152: D35.A 102.74,88.01 104.39,88.01 E1.A
N$14
  Bottom 0.152: 108.08,62.74 104.52,62.74 101.73,59.94 Q2.3 | 108.08,62.74 108.71,63.37 S9.K | 122.05,62.74 122.68,63.37 S10.K | 122.05,62.74 108.08,62.74 | 122.05,62.74 136.02,62.74 136.65,63.37 S11.K 137.67,63.63 138.3,64.26 152.27,64.26 | 152.27,64.26 151.64,63.63 S12.K | 163.96,64.26 152.27,64.26 | 163.96,64.26 164.59,63.63 S13.K | 177.93,64.26 178.56,63.63 S14.K | 177.93,64.26 163.96,64.26 | 191.9,64.26 192.53,63.63 S15.K | 191.9,64.26 177.93,64.26 | 191.9,64.26 205.87,64.26 206.5,63.63 S16.K
N$15
  Bottom 0.152: D36.A 113.16,88.01 110.87,88.01 E1.B
N$16
  Bottom 0.152: D63.A 140.84,101.98 138.81,101.98 E3.SW1
N$17
  Bottom 0.152: D46.A 126.87,101.98 124.84,101.98 E2.SW1
N$18
  Bottom 0.152: D70.A 154.81,101.98 152.78,101.98 E4.SW1
N$19
  Bottom 0.152: D97.A 168.78,101.98 166.75,101.98 E5.SW1
N$20
  Bottom 0.152: D17.A 106.55,53.59 104.78,53.59 S9.NO
N$21
  Bottom 0.152: D100.A 182.75,101.98 180.72,101.98 E6.SW1
N$22
  Bottom 0.152: D103.A 196.72,101.98 194.69,101.98 E7.SW1
N$23
  Bottom 0.152: D18.A 109.35,53.72 109.47,53.59 111.12,53.59 S9.NC
N$24
  Bottom 0.152: D106.A 200.41,99.19 202.44,101.22 206.63,101.22 207.26,101.85 E8.SW1
N$25
  Bottom 0.152: D44.A 116.71,88.01 118.36,88.01 E2.A
N$26
  Bottom 0.152: Q7.3 105.54,92.46 106.05,92.46 R15.2
N$27
  Bottom 0.152: D45.A 127.13,88.01 124.84,88.01 E2.B
N$28
  Bottom 0.152: D47.A 130.68,88.01 132.33,88.01 E3.A
N$29  (via drill 0.25)
  Top 0.152: v100.84,65.53 103.12,63.25 103.12,58.04 v105.66,55.5
  Bottom 0.152: D31.C 204.34,55.24 190.63,55.24 D29.C 190.37,55.24 176.66,55.24 D27.C 176.4,55.24 162.69,55.24 D25.C 162.43,55.24 148.72,55.24 D23.C 148.46,55.24 134.75,55.24 D21.C 134.49,55.24 120.78,55.24 D19.C 120.52,55.24 106.81,55.24 D17.C 106.55,55.5 v105.66,55.5 | v100.84,65.53 98.04,68.33 IC3.11
N$30
  Bottom 0.152: D5.A 134.49,72.64 132.72,72.64 S3.NO
N$31
  Bottom 0.152: D6.A 137.29,72.77 137.41,72.64 139.06,72.64 S3.NC
N$32
  Bottom 0.152: D7.A 148.46,72.64 146.69,72.64 S4.NO
N$33
  Bottom 0.152: D8.A 151.26,72.77 151.38,72.64 153.03,72.64 S4.NC
N$34
  Bottom 0.152: D9.A 162.43,72.64 160.66,72.64 S5.NO
N$35
  Bottom 0.152: D10.A 165.23,72.77 165.35,72.64 167,72.64 S5.NC
N$36
  Bottom 0.152: D11.A 176.4,72.64 174.62,72.64 S6.NO
N$37
  Bottom 0.152: D12.A 179.2,72.77 179.32,72.64 180.97,72.64 S6.NC
N$38
  Bottom 0.152: D13.A 190.37,72.64 188.59,72.64 S7.NO
N$39
  Bottom 0.152: D14.A 193.17,72.77 193.29,72.64 194.94,72.64 S7.NC
N$40
  Bottom 0.152: D15.A 204.34,72.64 202.56,72.64 S8.NO
N$41
  Bottom 0.152: D16.A 207.14,72.77 207.26,72.64 208.91,72.64 S8.NC
N$42  (via drill 0.25)
  Top 0.152: v99.57,65.53 102.74,62.36 102.74,57.15 v106.81,53.09
  Bottom 0.152: 122.94,52.32 109.47,52.32 109.35,52.45 D18.C 109.09,53.09 v106.81,53.09 | 122.94,52.32 123.06,52.45 D20.C | 136.91,52.32 137.03,52.45 D22.C | 136.91,52.32 122.94,52.32 | 150.88,52.32 151,52.45 D24.C | 150.88,52.32 136.91,52.32 | 164.85,52.32 164.97,52.45 D26.C | 164.85,52.32 150.88,52.32 | 178.82,52.32 178.94,52.45 D28.C | 178.82,52.32 164.85,52.32 | 192.79,52.32 192.91,52.45 D30.C | 192.79,52.32 178.82,52.32 | 192.79,52.32 206.76,52.32 206.88,52.45 D32.C | v99.57,65.53 98.04,67.06 IC3.12
N$43
  Bottom 0.152: R1.2 97.92,74.55 98.68,74.55 Q1.1
N$44
  Bottom 0.152: D48.A 141.1,88.01 138.81,88.01 E3.B
N$45
  Bottom 0.152: D19.A 120.52,53.59 118.75,53.59 S10.NO
N$46
  Bottom 0.152: D20.A 123.32,53.72 123.44,53.59 125.09,53.59 S10.NC
N$47
  Bottom 0.152: D64.A 144.65,88.01 146.3,88.01 E4.A
N$48
  Bottom 0.152: R3.2 128.91,42.29 129.54,42.29 Q3.1
N$49
  Bottom 0.152: D69.A 155.07,88.01 152.78,88.01 E4.B
N$50
  Bottom 0.152: D77.A 158.62,88.01 160.27,88.01 E5.A
N$51
  Bottom 0.152: Q4.1 122.56,23.24 R4.2
N$52
  Bottom 0.152: D78.A 169.04,88.01 166.75,88.01 E5.B
N$53
  Bottom 0.152: D98.A 172.59,88.01 174.24,88.01 E6.A
N$54
  Bottom 0.152: Q5.1 40.77,38.86 41.27,38.86 R5.2
N$55
  Bottom 0.152: D99.A 183.01,88.01 180.72,88.01 E6.B
N$56
  Bottom 0.152: D101.A 186.56,88.01 188.21,88.01 E7.A
N$57
  Bottom 0.152: Q6.1 10.79,22.99 R6.2
N$58
  Bottom 0.152: D102.A 196.98,88.01 194.69,88.01 E7.B
N$59
  Bottom 0.152: D21.A 134.49,53.59 132.72,53.59 S11.NO
N$60
  Bottom 0.152: D22.A 137.29,53.72 137.41,53.59 139.06,53.59 S11.NC
N$61
  Bottom 0.152: D23.A 148.46,53.59 146.69,53.59 S12.NO
N$62
  Bottom 0.152: D24.A 151.26,53.72 151.38,53.59 153.03,53.59 S12.NC
N$63
  Bottom 0.152: D25.A 162.43,53.59 160.66,53.59 S13.NO
N$64
  Bottom 0.152: D26.A 165.23,53.72 165.35,53.59 167,53.59 S13.NC
N$65
  Bottom 0.152: D27.A 176.4,53.59 174.62,53.59 S14.NO
N$66
  Bottom 0.152: D28.A 179.2,53.72 179.32,53.59 180.97,53.59 S14.NC
N$67
  Bottom 0.152: D29.A 190.37,53.59 188.59,53.59 S15.NO
N$68
  Bottom 0.152: D30.A 193.17,53.72 193.29,53.59 194.94,53.59 S15.NC
N$69
  Bottom 0.152: D31.A 204.34,53.59 202.56,53.59 S16.NO
N$70
  Bottom 0.152: D32.A 207.14,53.72 207.26,53.59 208.91,53.59 S16.NC
N$71  (via drill 0.25)
  Top 0.152: v131.32,39.88 130.94,39.5 130.94,38.61 S17.K
  Bottom 0.152: v131.32,39.88 130.81,39.88 Q3.3 | 159.89,38.86 159.26,38.23 S19.K | 159.89,38.86 171.58,38.86 | 171.58,38.86 172.21,38.23 S20.K | 171.58,38.86 185.55,38.86 186.18,38.23 S21.K | 159.89,38.86 153.29,38.86 153.16,38.73 145.67,38.73 145.29,38.35 134.62,38.35 134.11,38.86 131.95,38.86 131.32,38.23 S17.K
N$72
  Bottom 0.152: D104.A 200.53,88.01 202.18,88.01 E8.A
N$73
  Bottom 0.152: D33.A 128.14,28.19 126.36,28.19 S17.NO
N$74
  Bottom 0.152: D34.A 130.94,28.32 131.06,28.19 132.72,28.19 S17.NC
N$75
  Bottom 0.152: R2.2 98.17,59.05 98.93,59.05 Q2.1
N$76  (via drill 0.25)
  Top 0.152: v75.69,35.18 84.96,44.45 84.96,46.74 92.2,53.98 v92.2,65.41 | v113.28,35.18 v116.97,31.5
  Bottom 0.152: D41.C 184.02,29.84 170.31,29.84 D39.C 170.05,29.84 156.34,29.84 D37.C 156.08,29.46 153.8,29.46 152.15,27.81 141.1,27.81 139.32,29.59 128.4,29.59 D33.C 128.14,30.1 126.75,31.5 v116.97,31.5 | v92.2,65.41 92.58,65.79 96.14,65.79 IC3.13 | IC4.1 10.41,35.31 10.54,35.18 v75.69,35.18 v113.28,35.18
N$77
  Bottom 0.152: 158.5,26.92 131.06,26.92 130.94,27.05 D34.C 130.68,27.69 129.16,29.21 127.76,29.21 126.11,30.86 112.52,30.86 109.35,34.04 11.18,34.04 10.41,33.27 IC4.3 | 158.5,26.92 158.62,27.05 D38.C | 172.47,26.92 172.59,27.05 D40.C | 158.5,26.92 172.47,26.92 | 172.47,26.92 186.44,26.92 186.56,27.05 D42.C
N$78
  Bottom 0.152: D105.A 201.68,84.96 203.45,86.74 206.63,86.74 207.26,87.38 E8.B
N$80
  Bottom 0.152: C8.1 201.68,25.02 202.82,23.88 211.84,23.88 213.11,25.15 213.11,27.18 202.95,27.18 202.18,27.94 202.18,28.45 U1.20
N$81
  Bottom 0.152: C10.2 208.28,42.42 X1.2 208.03,41.53 207.9,41.53 204.6,38.23 U1.8
N$82
  Bottom 0.152: C9.2 203.58,45.97 203.58,42.42 X1.1 203.71,41.4 203.71,38.23 U1.7
N$83
  Top 0.152: U3.EN 68.2,74.17 82.8,88.77 82.8,99.69 83.44,100.33 93.34,100.33 95.76,97.92 95.76,94.23 96.52,94.23 S0.2
N$84
  Bottom 0.152: U5.27 42.42,62.23 42.42,68.45 41.78,68.45 C15.1
N$85  (via drill 0.25)
  Top 0.152: v96.52,75.82 98.55,73.79 v98.55,49.53
  Bottom 0.152: v96.52,75.82 97.03,75.82 R1.1 | IC2.3 v98.55,49.53
N$86  (via drill 0.25)
  Top 0.152: v95.76,48.9 v95.76,58.55
  Bottom 0.152: v95.76,58.55 97.41,60.2 R2.1 | v95.76,48.9 96.14,48.51 IC2.4
N$87
  Bottom 0.152: R3.1 127,42.55 97.16,42.55 94.87,44.83 94.87,46.74 96.14,46.74 IC2.5
N$88  (via drill 0.25)
  Top 0.152: v107.57,26.42 105.16,28.83 105.16,38.35 v98.42,45.09
  Bottom 0.152: v107.57,26.42 121.54,26.42 122.17,25.78 R4.1 | v98.42,45.09 98.04,45.47 IC2.6
N$89  (via drill 0.25)
  Top 0.152: v85.47,44.96 v87.25,46.74
  Bottom 0.152: v85.47,44.96 49.02,44.96 43.18,39.12 R5.1 | v87.25,46.74 89.92,46.74 IC2.10
N$90  (via drill 0.25)
  Top 0.152: v37.85,26.42 v58.17,46.74
  Bottom 0.152: v37.85,26.42 12.19,26.42 11.18,25.4 R6.1 | v58.17,46.74 58.55,47.12 86.11,47.12 87,48.01 89.92,48.01 IC2.11
N$91
  Bottom 0.152: Q8.3 119.51,92.46 120.02,92.46 R16.2
N$92
  Bottom 0.152: Q9.3 133.1,92.46 133.6,92.46 R17.2
N$93
  Bottom 0.152: Q10.3 147.07,92.46 147.57,92.46 R18.2
N$94
  Bottom 0.152: D37.A 156.08,28.19 154.31,28.19 S19.NO
N$95
  Bottom 0.152: D38.A 158.88,28.32 159,28.19 160.66,28.19 S19.NC
N$96
  Bottom 0.152: D39.A 170.05,28.19 168.28,28.19 S20.NO
N$97
  Bottom 0.152: D40.A 172.85,28.32 172.97,28.19 174.62,28.19 S20.NC
N$98
  Bottom 0.152: D41.A 184.02,28.19 182.25,28.19 S21.NO
N$99
  Bottom 0.152: D42.A 186.82,28.32 186.94,28.19 188.59,28.19 S21.NC
N$100
  Bottom 0.152: Q11.3 161.04,92.46 161.54,92.46 R19.2
N$101
  Bottom 0.152: Q12.3 174.37,92.46 174.88,92.46 R20.2
N$102
  Bottom 0.152: Q13.3 188.98,92.46 189.48,92.46 R21.2
N$103
  Bottom 0.152: Q14.3 202.95,92.46 203.45,92.46 R22.2
N$104
  Bottom 0.152: R23.2 101.98,91.44 102.74,91.44 Q7.1
N$105
  Bottom 0.152: R24.2 115.95,91.69 116.71,91.69 Q8.1
N$106
  Bottom 0.152: 123.19,19.81 Q4.3 | S25.K 123.19,19.81 | 136.02,19.81 136.65,19.18 S26.K | 123.19,19.81 136.02,19.81 | 149.99,19.81 150.62,19.18 S27.K | 136.02,19.81 149.99,19.81 | 163.96,19.81 164.59,19.18 S28.K | 149.99,19.81 163.96,19.81 | 177.93,19.81 178.56,19.18 S29.K | 163.96,19.81 177.93,19.81 | 191.9,19.81 192.53,19.18 S30.K | 177.93,19.81 191.9,19.81 | 191.9,19.81 205.87,19.81 206.5,19.18 S31.K
N$107
  Bottom 0.152: D49.A 120.52,9.14 118.75,9.14 S25.NO
N$108
  Bottom 0.152: D50.A 123.32,9.27 123.44,9.14 125.09,9.14 S25.NC
N$109
  Bottom 0.152: R25.2 129.67,91.69 130.43,91.69 Q9.1
N$110  (via drill 0.25)
  Top 0.152: v27.69,31.62 28.83,30.48 28.83,28.45 v45.85,11.43
  Bottom 0.152: D61.C 204.34,10.79 190.63,10.79 D59.C 190.37,10.79 176.66,10.79 D57.C 176.4,10.79 162.69,10.79 D55.C 162.43,10.79 148.72,10.79 D53.C 148.46,10.79 134.75,10.79 D51.C 134.49,10.79 120.78,10.79 D49.C 120.52,11.05 120.14,11.43 v45.85,11.43 | v27.69,31.62 10.41,31.62 IC4.4
N$111  (via drill 0.25)
  Top 0.152: v29.34,30.48 49.91,9.91 v121.79,9.91
  Bottom 0.152: 136.91,7.87 123.44,7.87 123.32,8 D50.C 123.06,8.64 v121.79,9.91 | 136.91,7.87 137.03,8 D52.C | 150.88,7.87 151,8 D54.C | 136.91,7.87 150.88,7.87 | 164.85,7.87 164.97,8 D56.C | 150.88,7.87 164.85,7.87 | 178.82,7.87 178.94,8 D58.C | 164.85,7.87 178.82,7.87 | 192.79,7.87 192.91,8 D60.C | 178.82,7.87 192.79,7.87 | 192.79,7.87 206.76,7.87 206.88,8 D62.C | IC4.5 v29.34,30.48
N$112  (via drill 0.25)
  Top 0.152: v67.44,70.1 69.22,70.1 69.22,72.9 v81.53,85.22
  Bottom 0.152: v67.44,70.1 57.78,60.45 45.72,60.45 U5.3 | v81.53,85.22 81.53,91.06 C16.2
N$113
  Bottom 0.152: D51.A 134.49,9.14 132.72,9.14 S26.NO
N$114
  Bottom 0.152: D52.A 137.29,9.27 137.41,9.14 139.06,9.14 S26.NC
N$115  (via drill 0.25)